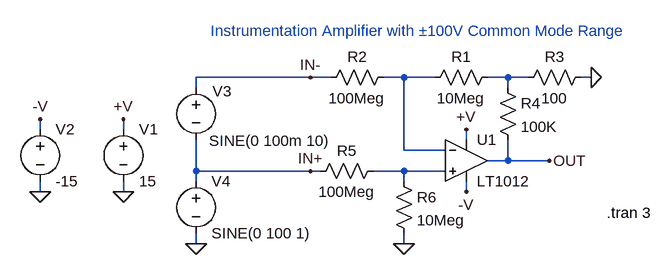
[diagram p0: schematic 1012.asc]
1012.asc, the LTspice schematic file:
Version 4
SHEET 1 896 680
WIRE -48 112 -224 112
WIRE -16 112 -48 112
WIRE 96 112 64 112
WIRE 144 112 96 112
WIRE 256 112 224 112
WIRE 288 112 256 112
WIRE 384 112 368 112
WIRE -224 128 -224 112
WIRE 256 128 256 112
WIRE -464 192 -464 176
WIRE -336 192 -336 176
WIRE 192 208 192 192
WIRE 96 224 96 112
WIRE 160 224 96 224
WIRE 256 240 256 208
WIRE 256 240 224 240
WIRE 320 240 256 240
WIRE -224 256 -224 208
WIRE -48 256 -224 256
WIRE -32 256 -48 256
WIRE 96 256 48 256
WIRE 160 256 96 256
WIRE -224 272 -224 256
WIRE 96 272 96 256
WIRE -464 288 -464 272
WIRE -336 288 -336 272
WIRE 192 288 192 272
WIRE -224 368 -224 352
WIRE 96 368 96 352
FLAG -336 288 0
FLAG 192 192 +V
FLAG -336 176 +V
FLAG 192 288 -V
FLAG -464 288 0
FLAG -464 176 -V
FLAG -224 368 0
FLAG 384 112 0
FLAG 96 368 0
FLAG 320 240 OUT
FLAG -48 256 IN+
FLAG -48 112 IN-
SYMBOL voltage -336 176 R0
SYMATTR InstName V1
SYMATTR Value 15
SYMBOL voltage -464 176 R0
SYMATTR InstName V2
SYMATTR Value -15
SYMBOL res 240 96 R90
WINDOW 0 0 56 VBottom 0
WINDOW 3 32 56 VTop 0
SYMATTR InstName R1
SYMATTR Value 10Meg
SYMBOL res 80 96 R90
WINDOW 0 0 56 VBottom 0
WINDOW 3 32 56 VTop 0
SYMATTR InstName R2
SYMATTR Value 100Meg
SYMBOL voltage -224 112 R0
WINDOW 0 25 21 Left 0
WINDOW 3 20 97 Left 0
SYMATTR InstName V3
SYMATTR Value SINE(0 100m 10)
SYMBOL opamps\\LT1012 192 176 R0
SYMATTR InstName U1
SYMBOL res 384 96 R90
WINDOW 0 0 56 VBottom 0
WINDOW 3 32 56 VTop 0
SYMATTR InstName R3
SYMATTR Value 100
SYMBOL res 240 112 R0
SYMATTR InstName R4
SYMATTR Value 100K
SYMBOL res 64 240 R90
WINDOW 0 0 56 VBottom 0
WINDOW 3 32 56 VTop 0
SYMATTR InstName R5
SYMATTR Value 100Meg
SYMBOL res 80 256 R0
SYMATTR InstName R6
SYMATTR Value 10Meg
SYMBOL voltage -224 256 R0
SYMATTR InstName V4
SYMATTR Value SINE(0 100 1)
TEXT 408 320 Left 0 !.tran 3
TEXT 120 56 Bottom 0 ;Instrumentation Amplifier with ±100V Common Mode Range

The netlist it stands for:
* 1012.asc
V1 +V 0 15
V2 -V 0 -15
R1 N002 N001 10Meg
R2 N001 IN- 100Meg
V3 IN- IN+ SINE(0 100m 10)
XU1 N003 N001 +V -V OUT LT1012  ; pins In+ In- V+ V- OUT
R3 0 N002 100
R4 N002 OUT 100K
R5 N003 IN+ 100Meg
R6 N003 0 10Meg
V4 IN+ 0 SINE(0 100 1)
.tran 3
* Instrumentation Amplifier with ±100V Common Mode Range
.backanno
.end